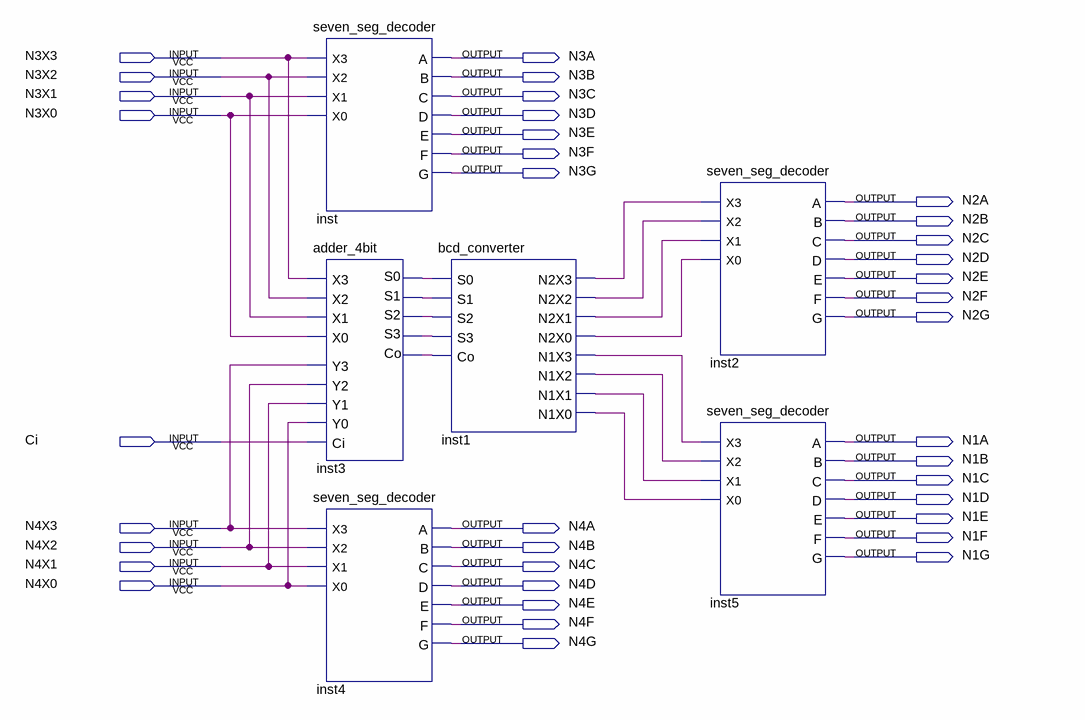
[diagram p0: schematic sheet]
// Quartus schematic lab6.bdf as structural Verilog: 6 symbols, 37 pins
module lab6 (
  input  N3X3,
  input  N3X2,
  input  N3X1,
  input  N3X0,
  input  Ci,
  input  N4X3,
  input  N4X2,
  input  N4X1,
  input  N4X0,
  output N3A,
  output N3B,
  output N3C,
  output N3D,
  output N3E,
  output N3F,
  output N3G,
  output N2A,
  output N2B,
  output N2C,
  output N2D,
  output N2E,
  output N2F,
  output N2G,
  output N1A,
  output N1B,
  output N1C,
  output N1D,
  output N1E,
  output N4A,
  output N1F,
  output N4B,
  output N1G,
  output N4C,
  output N4D,
  output N4E,
  output N4F,
  output N4G
);

  wire inst1_n1x0, inst1_n1x1, inst1_n1x2, inst1_n1x3, inst1_n2x0, inst1_n2x1, inst1_n2x2, inst1_n2x3,
       inst3_co, inst3_s0, inst3_s1, inst3_s2, inst3_s3;

  seven_seg_decoder inst (
    .X3(N3X3), .X2(N3X2), .X1(N3X1), .X0(N3X0), .A(N3A), .B(N3B), .C(N3C), .D(N3D), .E(N3E), .F(N3F), .G(N3G));
  adder_4bit inst3 (
    .X3(N3X3), .Y3(N4X3), .X2(N3X2), .Y2(N4X2), .X1(N3X1), .Y1(N4X1), .X0(N3X0), .Y0(N4X0), .Ci(Ci),
    .S0(inst3_s0), .S1(inst3_s1), .S2(inst3_s2), .S3(inst3_s3), .Co(inst3_co));
  seven_seg_decoder inst4 (
    .X3(N4X3), .X2(N4X2), .X1(N4X1), .X0(N4X0), .A(N4A), .B(N4B), .C(N4C), .D(N4D), .E(N4E), .F(N4F), .G(N4G));
  bcd_converter inst1 (
    .S0(inst3_s0), .S1(inst3_s1), .S2(inst3_s2), .S3(inst3_s3), .Co(inst3_co), .N2X3(inst1_n2x3),
    .N2X2(inst1_n2x2), .N2X1(inst1_n2x1), .N2X0(inst1_n2x0), .N1X3(inst1_n1x3), .N1X2(inst1_n1x2),
    .N1X1(inst1_n1x1), .N1X0(inst1_n1x0));
  seven_seg_decoder inst2 (
    .X3(inst1_n2x3), .X2(inst1_n2x2), .X1(inst1_n2x1), .X0(inst1_n2x0), .A(N2A), .B(N2B), .C(N2C), .D(N2D),
    .E(N2E), .F(N2F), .G(N2G));
  seven_seg_decoder inst5 (
    .X3(inst1_n1x3), .X2(inst1_n1x2), .X1(inst1_n1x1), .X0(inst1_n1x0), .A(N1A), .B(N1B), .C(N1C), .D(N1D),
    .E(N1E), .F(N1F), .G(N1G));
endmodule
